# EAGLE design Pixie2313 (EAGLE 6.5.0)
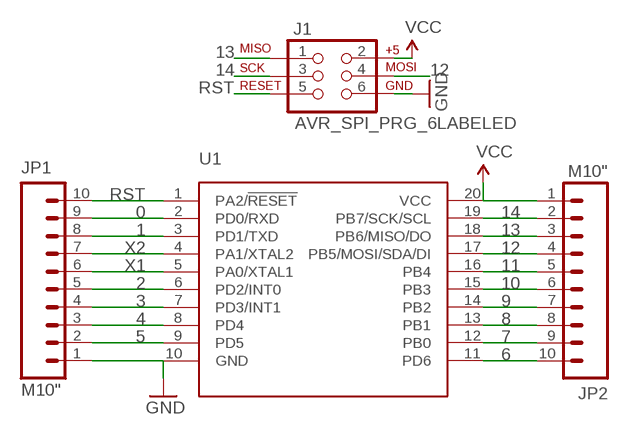
[diagram p0: schematic, sheet 1]

## Parts
J1  AVR_SPI_PRG_6LABELED  [2X3-NS]
JP1  M10"  [1X10]
JP2  M10"  [1X10]
U1  ATTINY2313APTH  [DIL20]

## Nets
0: JP1.9 U1.2(PD0/RXD)
1: JP1.8 U1.3(PD1/TXD)
2: JP1.5 U1.6(PD2/INT0)
3: JP1.4 U1.7(PD3/INT1)
4: JP1.3 U1.8(PD4)
5: JP1.2 U1.9(PD5)
6: JP2.10 U1.11(PD6)
7: JP2.9 U1.12(PB0)
8: JP2.8 U1.13(PB1)
9: JP2.7 U1.14(PB2)
10: JP2.6 U1.15(PB3)
11: JP2.5 U1.16(PB4)
12: J1.4 JP2.4 U1.17(PB5/MOSI/SDA/DI)
13: J1.1 JP2.3 U1.18(PB6/MISO/DO)
14: J1.3 JP2.2 U1.19(PB7/SCK/SCL)
GND: J1.6 JP1.1 U1.10(GND)
RST: J1.5 JP1.10 U1.1(PA2/!RESET)
VCC: J1.2 JP2.1 U1.20(VCC)
X1: JP1.6 U1.5(PA0/XTAL1)
X2: JP1.7 U1.4(PA1/XTAL2)

## Library data of the parts
J1 = barbary_enterprises:AVR_SPI_PRG_6: AVR ISP 6 Pin This is the reduced ISP connector for AVR programming. Common on Arduino. This footprint will take up less PCB space and can be used with a 10-pin to 6-pin adapter such as SKU: BOB-08508
JP1 JP2 = SparkFun-Connectors:M10: Header 10 Standard 10-pin 0.1" header. Use with straight break away headers (SKU : PRT-00116), right angle break away headers (PRT-00553), swiss pins (PRT-00743), machine pins (PRT-00117), and female headers (PRT-00115).
U1 = SparkFun-DigitalIC:ATTINY2313A: ATTINY2313A 2kB 20MHz I2C/SPI/UART

## Board
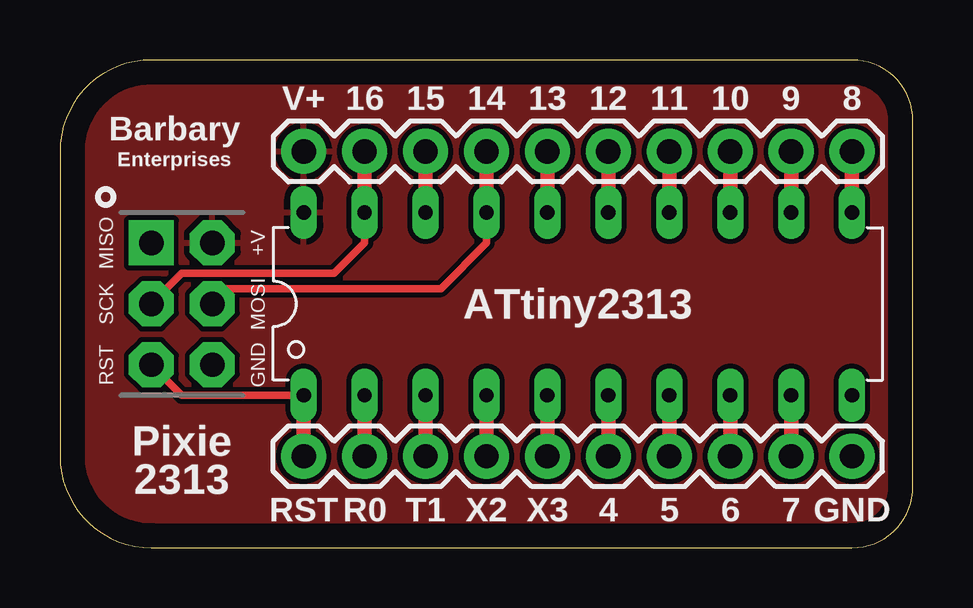
[diagram p1: board, top side]
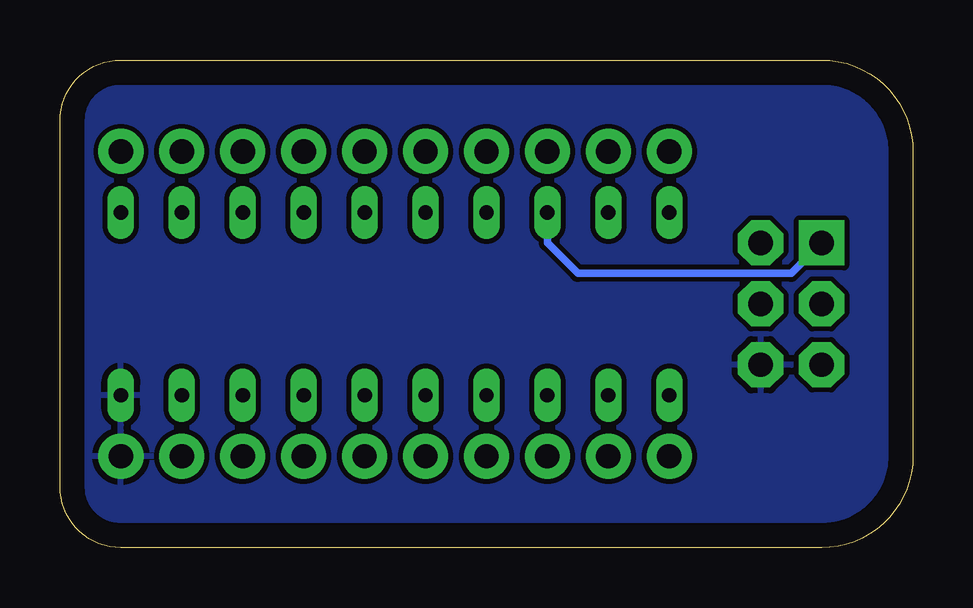
[diagram p2: board, bottom side, seen from below]

Size 35.56 x 20.32 mm. Coordinates in mm from the lower left corner, seen from the top.
Outline: 0,16.51 0,3.81 arc90 3.81,0 33.02,0 arc90 35.56,2.54 35.56,17.78 arc90 33.02,20.32 3.81,20.32 arc90 0,16.51
Copper layers (1*16): Top 0.035mm / dielectric 1.5mm / Bottom 0.035mm
Design rules "default": minimum track width 10mil, minimum drill 24mil, track to track 8mil, track to pad 8mil, pad to pad 8mil, via to via 8mil, smd to smd 8mil, copper to edge 40mil, drill to drill 8mil, minimum pad ring 10mil, minimum via ring 8mil, stop-mask expansion 4mil, vias tented up to drill 0mil, thermal gap 10mil

### Footprints (pad centres in the part's own frame; a part is rotated, then mirrored left to right if it is on the bottom)
2X3-NS = drill 1.016 pad 1.88 square: 1 -2.54,-1.27 | drill 1.016 pad 1.88 octagon: 2 -2.54,1.27; 3 0,-1.27; 4 0,1.27; 5 2.54,-1.27; 6 2.54,1.27
1X10 = drill 1.016 pad 1.88: 1 0,0; 2 2.54,0; 3 5.08,0; 4 7.62,0; 5 10.16,0; 6 12.7,0; 7 15.24,0; 8 17.78,0; 9 20.32,0; 10 22.86,0
DIL20 = drill 0.6 long: 1 -11.43,-3.81; 2 -8.89,-3.81; 3 -6.35,-3.81; 4 -3.81,-3.81; 5 -1.27,-3.81; 6 1.27,-3.81; 7 3.81,-3.81; 8 6.35,-3.81; 9 8.89,-3.81; 10 11.43,-3.81; 11 11.43,3.81; 12 8.89,3.81; 13 6.35,3.81; 14 3.81,3.81; 15 1.27,3.81; 16 -1.27,3.81; 17 -3.81,3.81; 18 -6.35,3.81; 19 -8.89,3.81; 20 -11.43,3.81

### Placement (x,y rotation side)
J1  5.08,10.16 270 top
JP1  33.02,3.81 180 top
JP2  10.16,16.51 0 top
U1  21.59,10.16 0 top

### Tracks (layer width: path | path; a pad name or v marks a point on that pad's centre or on a via)
0
  Top 0.61: U1.2 JP1.9
1
  Top 0.61: U1.3 JP1.8
2
  Top 0.61: U1.6 JP1.5
3
  Top 0.61: U1.7 JP1.4
4
  Top 0.61: U1.8 JP1.3
5
  Top 0.61: U1.9 JP1.2
6
  Top 0.61: JP2.10 U1.11
7
  Top 0.61: JP2.9 U1.12
8
  Top 0.61: JP2.8 U1.13
9
  Top 0.61: JP2.7 U1.14
10
  Top 0.61: JP2.6 U1.15
11
  Top 0.61: JP2.5 U1.16
12
  Top 0.305: J1.4 6.99,10.79 15.88,10.79 17.78,12.7 U1.17
  Top 0.61: JP2.4 U1.17
13
  Top 0.61: JP2.3 U1.18
  Bottom 0.305: J1.1 5.08,11.43 13.97,11.43 15.24,12.7 U1.18
14
  Top 0.305: J1.3 5.08,11.43 11.43,11.43 12.7,12.7 U1.19
  Top 0.61: JP2.2 U1.19
GND
  pour Bottom: 0,16.51 0,3.81 arc90 3.81,0 33.02,0 arc90 35.56,2.54 35.56,17.78 arc90 33.02,20.32 3.81,20.32 arc90
RST
  Top 0.305: J1.5 5.08,6.35 U1.1
  Top 0.61: JP1.10 U1.1
VCC
  pour Top: 0,16.51 0,3.81 arc90 3.81,0 33.02,0 arc90 35.56,2.54 35.56,17.78 arc90 33.02,20.32 3.81,20.32 arc90
X1
  Top 0.61: U1.5 JP1.6
X2
  Top 0.61: U1.4 JP1.7

### Text on the board
tPlace: V+ | 16 | 15 | 14 | 13 | 12 | 11 | 10 | 9 | 8 | Barbary | Enterprises | ATtiny2313 | Pixie | 2313 | RST | R0 | T1 | X2 | X3 | 4 | 5 | 6 | 7 | GND